# EAGLE schematic stir-shield (EAGLE 9.3.0)
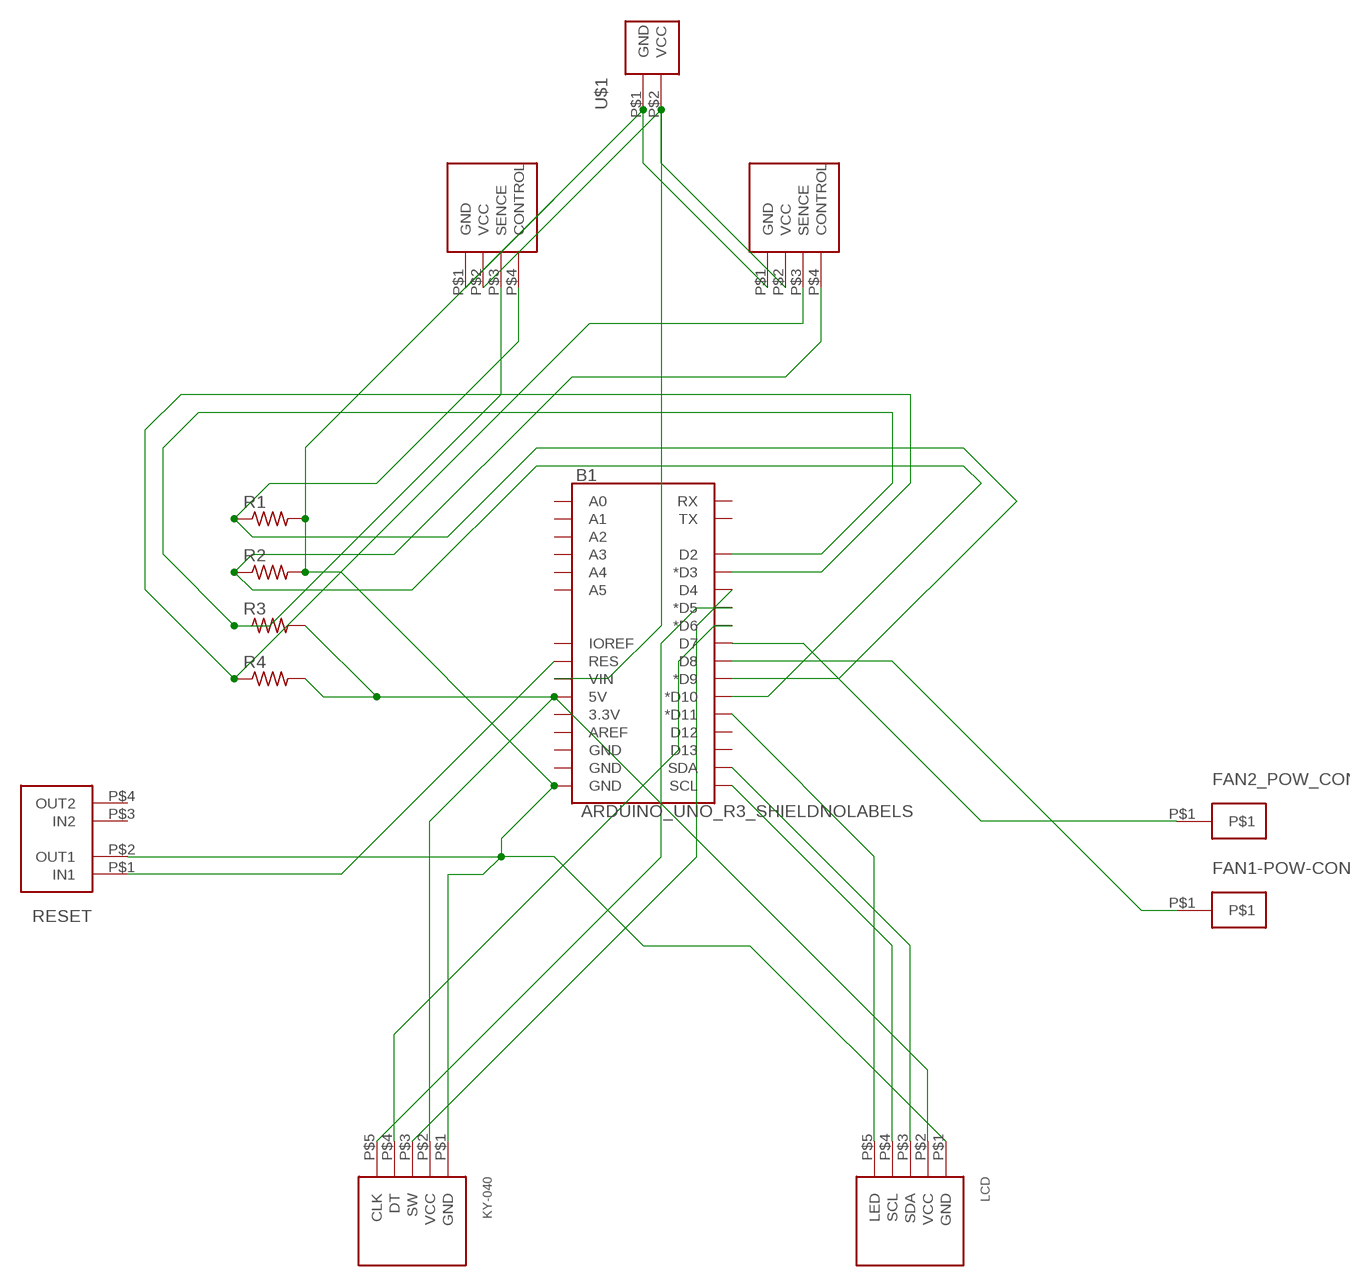
[diagram p0: schematic, sheet 1]

## Parts
B1  ARDUINO_UNO_R3_SHIELDNOLABELS  [UNO_R3_SHIELD_NOLABELS]
FAN1  4PIN  [4PIN]
FAN1-POW-CON  1PIN  [1PIN]
FAN2  4PIN  [4PIN]
FAN2_POW_CON  1PIN  [1PIN]
KY-040  5PIN_KY-04  [5PIN_KY-04]
LCD  5PIN_LCD  [5PIN_LCD]
R1  FLIPFLOP-RES  [0805-THM]
R2  FLIPFLOP-RES  [0805-THM]
R3  FLIPFLOP-RES  [0805-THM]
R4  FLIPFLOP-RES  [0805-THM]
RESET  BUTTON  [BUTTON]
U$1  2PIN  [2PIN]

## Nets
N$1: B1.D8 FAN1-POW-CON.P$1
N$2: B1.VIN FAN1.P$2(VCC) FAN2.P$2(VCC) U$1.P$2(VCC)
N$3: B1.D9(*D9) FAN1.P$4(CONTROL) R1.1
N$4: B1.D10(*D10) FAN2.P$4(CONTROL) R2.1
N$5: B1.5V KY-040.P$2(VCC) LCD.P$2(VCC) R3.2 R4.2
N$6: B1.D2 FAN1.P$3(SENCE) R3.1
N$7: B1.D3(*D3) FAN2.P$3(SENCE) R4.1
N$8: B1.D11(*D11) LCD.P$5(LED)
N$9: B1.D7 FAN2_POW_CON.P$1
N$10: B1.SCL LCD.P$4(SCL)
N$11: B1.SDA LCD.P$3(SDA)
N$12: B1.D4 KY-040.P$3(SW)
N$13: B1.D6(*D6) KY-040.P$4(DT)
N$14: B1.D5(*D5) KY-040.P$5(CLK)
N$18: B1.GND@0(GND) FAN1.P$1(GND) FAN2.P$1(GND) KY-040.P$1(GND) LCD.P$1(GND) R1.2 R2.2 RESET.P$2(OUT1) U$1.P$1(GND)
RESET: B1.RES RESET.P$1(IN1)
Unconnected: B1.3.3V B1.A0 B1.A1 B1.A2 B1.A3 B1.A4 B1.A5 B1.AREF B1.D12 B1.D13 B1.GND@1(GND) B1.GND@2(GND) B1.IOREF B1.RX B1.TX RESET.P$3(IN2) RESET.P$4(OUT2)

## Library data of the parts
B1 = SparkFun-Boards:ARDUINO_UNO_R3_SHIELD: Arduino R3 Shield Footprint Shield form compatible with the Arduino Uno R3. SparkFun Products: MG2639 Cellular Shield <https://www.sparkfun.com/products/13120> MIDI Shield <https://www.sparkfun.com/products/12898> R3 Stackable Headers Kit <https://www.sparkfun.com/products/11417>
FAN1 FAN2 = stir_shield:4PIN
FAN1-POW-CON FAN2_POW_CON = stir_shield:1PIN
KY-040 = stir_shield:5PIN_KY-04
LCD = stir_shield:5PIN_LCD
R1-R4 = adafruit:FLIPFLOP-RES: Flip Flop resistor An 0805 resistor inside a standard 1/4W 5% resistor. Makes for easy mods
RESET = stir_shield:BUTTON
U$1 = stir_shield:2PIN

## Net classes
0 default: width 0.4 mm, clearance 0.25 mm